# Altium schematic sheet Slave2.SchDoc
size A4; SheetNumber: 5; SheetTotal: 7
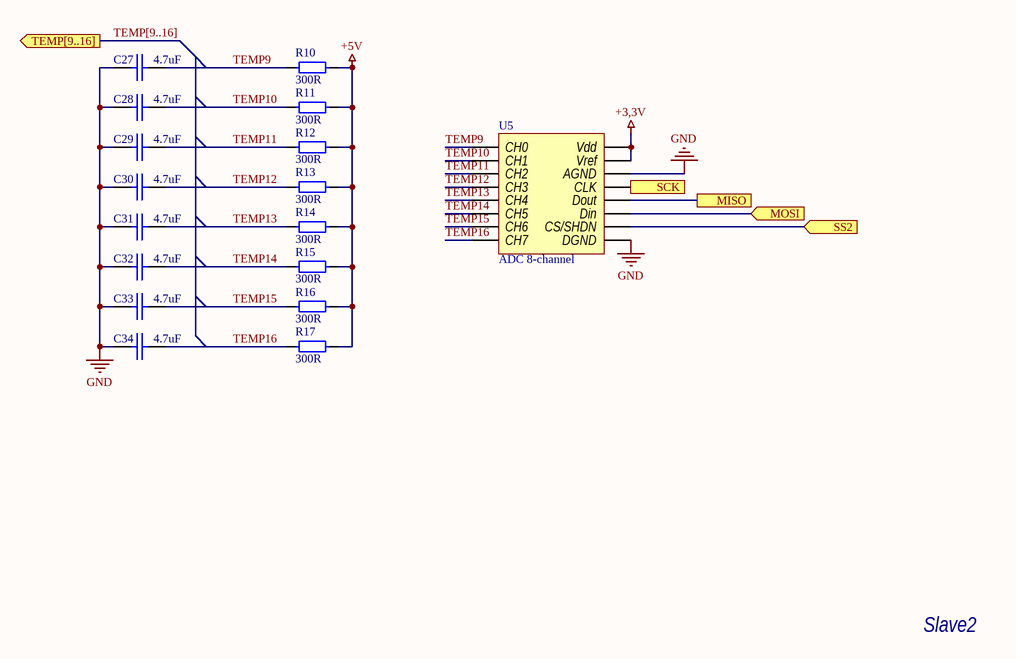
[diagram p0: Slave2.SchDoc]

## Parts
C27  4.7uF  [0603 Capicator]
C28  4.7uF  [0603 Capicator]
C29  4.7uF  [0603 Capicator]
C30  4.7uF  [0603 Capicator]
C31  4.7uF  [0603 Capicator]
C32  4.7uF  [0603 Capicator]
C33  4.7uF  [0603 Capicator]
C34  4.7uF  [0603 Capicator]
R10  300R  [0603 Resistor]
R11  300R  [0603 Resistor]
R12  300R  [0603 Resistor]
R13  300R  [0603 Resistor]
R14  300R  [0603 Resistor]
R15  300R  [0603 Resistor]
R16  300R  [0603 Resistor]
R17  300R  [0603 Resistor]
U5  ADC 8-channel  [SOIC-16]

## Ports
MISO, MOSI (in), SCK, SS2 (in), TEMP[9..16] (out)

## Nets
+3,3V: U5.15(Vref) U5.16(Vdd)
+5V: R10.2 R11.2 R12.2 R13.2 R14.2 R15.2 R16.2 R17.2
GND: C27.1 C28.1 C29.1 C30.1 C31.1 C32.1 C33.1 C34.1 U5.9(DGND) U5.14(AGND)
MISO: U5.12(Dout) ; port MISO
MOSI: U5.11(Din) ; port MOSI
SCK: U5.13(CLK) ; port SCK
SS2: U5.10(CS/SHDN) ; port SS2
TEMP9: C27.2 R10.1 U5.1(CH0)
TEMP10: C28.2 R11.1 U5.2(CH1)
TEMP11: C29.2 R12.1 U5.3(CH2)
TEMP12: C30.2 R13.1 U5.4(CH3)
TEMP13: C31.2 R14.1 U5.5(CH4)
TEMP14: C32.2 R15.1 U5.6(CH5)
TEMP15: C33.2 R16.1 U5.7(CH6)
TEMP16: C34.2 R17.1 U5.8(CH7)

## Buses and harness runs
bus TEMP[9..16] = port TEMP[9..16]

## Notes on the sheet
- Slave2

## Library data of the parts
C27-C34 = Cap 4.7uF (0603): 4.7uF X5R 25V 10% 0603; Manufacturer: Murata Manufacturing; Part Number: GRM188R61E475KE11D; Type: Capacitor; ComponentLink1Description: Chip&Dip; ComponentLink1URL: https://www.chipdip.ru/product0/9000348448
R10-R17 = Res 300R (0603): 0.1W 0603 300R, 1%; Part Number: RC0603FR-07360RL; Manufacturer: Taiwan; Type: Resistor; ComponentLink1Description: Chip&Dip; ComponentLink1URL: https://www.chipdip.ru/product0/9000079629
U5 = MCP3008-I/SL: A/D converter with SPI serial interface; Manufacturer: Microchip; Part Number: MCP3008-I/SL; Type: IC; ComponentLink1Description: ChipDip; ComponentLink1URL: https://www.chipdip.ru/product/mcp3008-i-sl; ComponentLink2Description: Datadheet; ComponentLink2URL: https://static.chipdip.ru/lib/527/DOC011527685.pdf